# Altium schematic sheet Sensors.SchDoc
size A
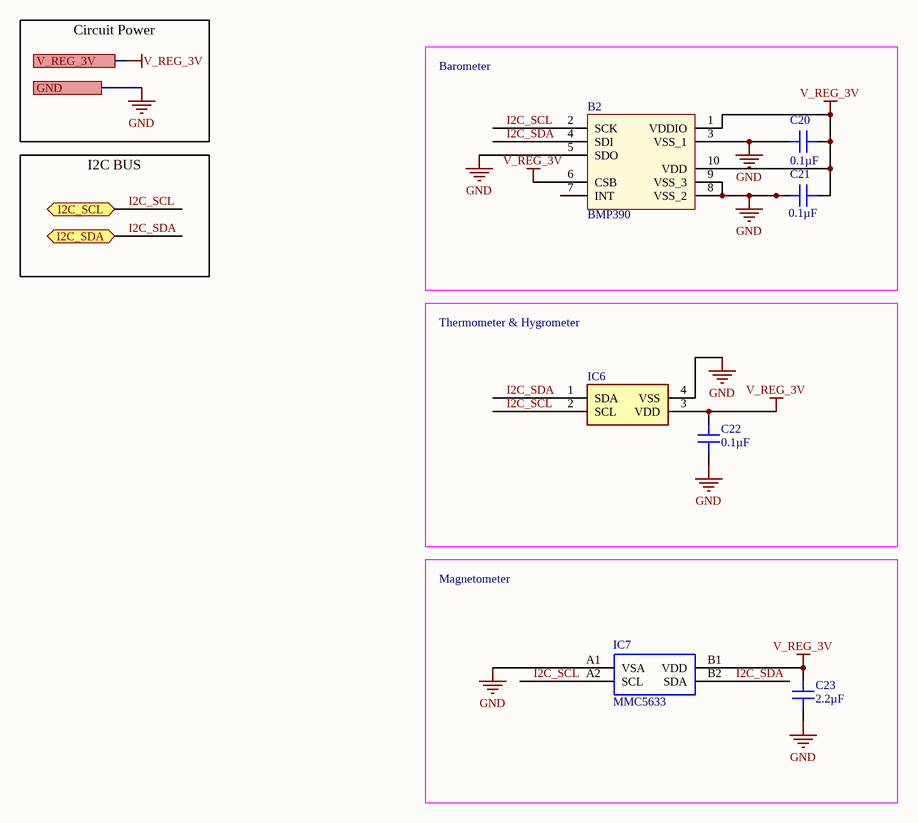
[diagram p0: Sensors.SchDoc]

## Parts
B2  BMP390  [BMP390]
C20  0.1µF  [CAP 0603_1608 RF]
C21  0.1µF  [CAP 0603_1608 RF]
C22  0.1µF  [CAP 0402_1005]
C23  2.2µF  [CAP 0402_1005 RF]
IC6  -40°C ~ 125°C Temp Sense  [SENSIRION SHT45]  (value not drawn)
IC7  MMC5633  [MEMSIC MMC5633]

## Blocks framed on the sheet
Barometer: B2 C20 C21
Thermometer & Hygrometer: C22 IC6
Magnetometer: C23 IC7

## Ports
GND, I2C_SCL (bidir), I2C_SDA (bidir), V_REG_3V

## Nets
GND: B2.3(VSS_1) B2.5(SDO) B2.8(VSS_2) B2.9(VSS_3) C20.1 C21.1 C22.1 C23.1 IC6.4(VSS) IC7.A1(VSA) ; port GND
V_REG_3V: B2.1(VDDIO) B2.6(CSB) B2.10(VDD) C20.2 C21.2 C22.2 C23.2 IC6.3(VDD) IC7.B1(VDD) ; port V_REG_3V
I2C_SCL: B2.2(SCK) IC6.2(SCL) IC7.A2(SCL) ; port I2C_SCL
I2C_SDA: B2.4(SDI) IC6.1(SDA) IC7.B2(SDA) ; port I2C_SDA

Not connected (* = marked no-connect by the designer): B2 7(INT)

## Notes on the sheet
- Circuit Power
- I2C BUS

## Library data of the parts
B2 = TMP00004: PRESSURE; Manufacturer_Name: Bosch Sensortec; Manufacturer: BOSCH; Geometry.Height: 0.8mm; VALUE: -40°C ~ 125°C Temp Sense; Sensor Type: Digital, Local; Sensing Temperature - Local: -40°C ~ 125°C; Output Type: I²C/SMBus; Voltage - Supply: 1.08V ~ 3.6V; Resolution: 16B; Accuracy - Highest (Lowest): ±2°C (±3°C); Test Condition: -10°C ~ 100°C (-40°C ~ 125°C); Mouser Part Number: 262-BMP390; Mouser Price/Stock: https://www.mouser.co.uk/ProductDetail/Bosch-Sensortec/BMP390?qs=QNEnbhJQKvYQVfvRMgo2YA%3D%3D; Manufacturer_Part_Number: BMP390; Datasheet Link: https://www.bosch-sensortec.com/media/boschsensortec/downloads/datasheets/bst-bmp390-ds002.pdf; Device ID: TMP00004; Part Type: IC; Manufacturer P/N: BMP390; Operating Temperature: -40°C ~ 125°C; Package: 10-DFN; Mounting Type: Surface Mount; Sensing Temperature - Remote: -; Features: One-Shot, Shutdown Mode; Supplier1: Digi-Key; Supplier1 P/N: 403-SHT45-AD1B-R3; Supplier2: Mouser; Supplier2 P/N: 1649-SHT45-AD1B-R3TR-ND
C20 C21 = CAP00039: CAP CER 0.1UF 16V X7R 0603; Manufacturer: KEMET; Manufacturer P/N: C0603C104M4RACAUTO; Tolerance: ±20%; Device ID: CAP00039; Mounting Type: Surface Mount; Part Type: Capacitor; VALUE: 0.1µF; Operating Temperature: -55°C ~ 125°C; Voltage: 16V; Package: 0603 (1608 Metric); Supplier1: Digi-Key; Supplier1 P/N: 399-C0603C104M4RACAUTOCT-ND; Supplier2: Mouser; Supplier2 P/N: C0603C104M4RACAUTO; Temperature Coefficient: X7R
C22 = CAP00001: CAP CER 0.1UF 16V X7R 0402; Manufacturer: KEMET; Manufacturer P/N: C0402C104K4RAC7411; Tolerance: ±10%; Device ID: CAP00001; Mounting Type: Surface Mount; Part Type: Capacitor; VALUE: 0.1µF; Operating Temperature: -55°C ~ 125°C; Voltage: 16V; Package: 0402 (1005 Metric); Supplier1: Digi-Key; Supplier1 P/N: 399-C0402C104K4RAC7411CT-ND; Supplier2: Mouser; Supplier2 P/N: 80-C0402C104K4R7411; Temperature Coefficient: X7R
C23 = CAP00028: CAP CER 2.2UF 10V X7S 0402; Manufacturer: Murata Electronics; Manufacturer P/N: GRT155C71A225KE13D; Tolerance: ±10%; Device ID: CAP00028; Mounting Type: Surface Mount; Part Type: Capacitor; VALUE: 2.2µF; Operating Temperature: -55°C ~ 125°C; Voltage: 10V; Package: 0402 (1005 Metric); Supplier1: Digi-Key; Supplier1 P/N: 490-16304-1-ND; Supplier2: Mouser; Supplier2 P/N: 81-GRT155C71A225KE3D; Temperature Coefficient: X7S
IC6 = TMP00003: SENSOR HUMID/TEMP HIGH ACCURACY; Manufacturer: Sensirion AG; Manufacturer P/N: SHT45-AD1B-R3; Sensor Type: Digital, Local; Output Type: I²C/SMBus; Voltage - Supply: 1.08V ~ 3.6V; Resolution: 16B; Accuracy - Highest (Lowest): ±2°C (±3°C); Test Condition: -10°C ~ 100°C (-40°C ~ 125°C); Device ID: TMP00003; Part Type: IC; VALUE: -40°C ~ 125°C Temp Sense; Operating Temperature: -40°C ~ 125°C; Package: 4-DFN; Mounting Type: Surface Mount; Sensing Temperature - Local: -40°C ~ 125°C; Sensing Temperature - Remote: -; Features: One-Shot, Shutdown Mode; Supplier1: Digi-Key; Supplier1 P/N: 403-SHT45-AD1B-R3; Supplier2: Mouser; Supplier2 P/N: 1649-SHT45-AD1B-R3TR-ND
IC7 = MAG00002: 30 GAUSS, MONOLITHIC, HIGH PERFO; Manufacturer: MEMSIC; Manufacturer P/N: MMC5633NJL; VALUE: Magnetoresistive Sensor X, Y, Z Axis; Axis: Triple; Output Type: I²C; Sensing Range: ±3mT; Voltage - Supply: 1.62V ~ 3.6V; Current - Supply (Max): 0.4µA (Typ); Resolution: 20b; Bandwidth: 1kKz; Device ID: MAG00002; Part Type: IC; Package: BGA-2x2; Mounting Type: Surface Mount; Operating Temperature: -40°C ~ 125°C (TA); Technology: Hall Effect; Current - Output (Max): -; Features: Temperature Compensated; Supplier1: Digi-Key; Supplier1 P/N: 1267-MMC5633NJLTR-ND; Supplier2: Mouser; Supplier2 P/N: 438-MMC5633NJL